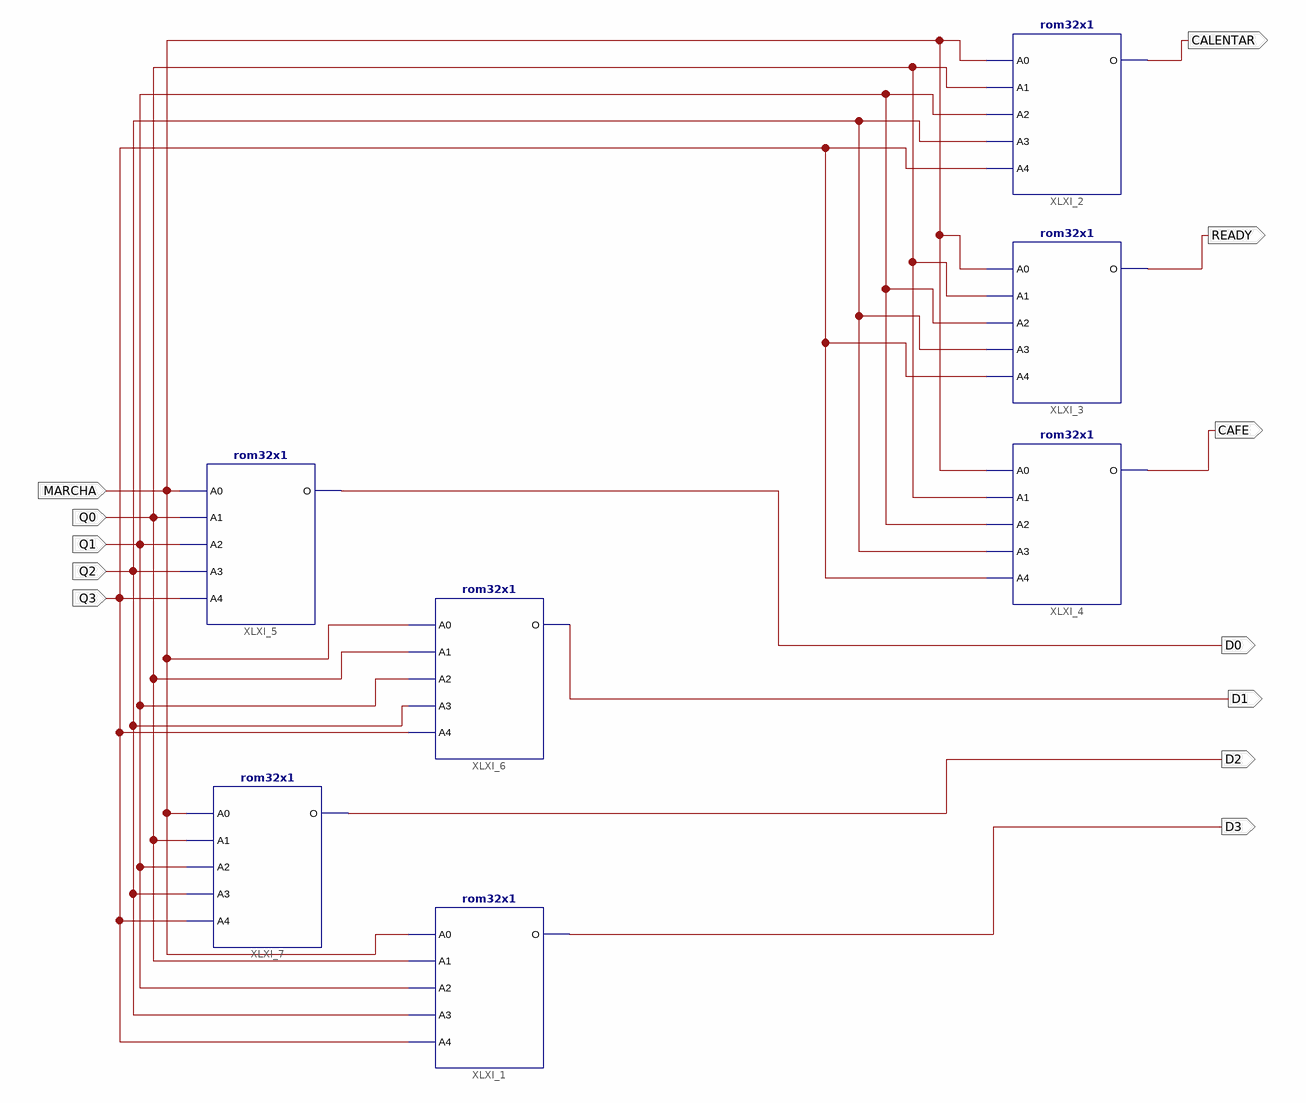
[diagram p0: schematic sheet 1]
// Xilinx ISE schematic Memoria.sch (spartan3) as structural Verilog: 7 symbols, 12 ports
module Memoria (
  input  MARCHA,
  input  Q0,
  input  Q1,
  input  Q2,
  input  Q3,
  output D0,
  output D1,
  output D2,
  output D3,
  output CALENTAR,
  output READY,
  output CAFE
);

  rom32x1 #(.INIT("00FFC000")) XLXI_1 (.A0(MARCHA), .A1(Q0), .A2(Q1), .A3(Q2), .A4(Q3), .O(D3));
  rom32x1 #(.INIT("000000FC")) XLXI_2 (.A0(MARCHA), .A1(Q0), .A2(Q1), .A3(Q2), .A4(Q3), .O(CALENTAR));
  rom32x1 #(.INIT("00000300")) XLXI_3 (.A0(MARCHA), .A1(Q0), .A2(Q1), .A3(Q2), .A4(Q3), .O(READY));
  rom32x1 #(.INIT("03FFFC00")) XLXI_4 (.A0(MARCHA), .A1(Q0), .A2(Q1), .A3(Q2), .A4(Q3), .O(CAFE));
  rom32x1 #(.INIT("00333233")) XLXI_5 (.A0(MARCHA), .A1(Q0), .A2(Q1), .A3(Q2), .A4(Q3), .O(D0));
  rom32x1 #(.INIT("003C3C3C")) XLXI_6 (.A0(MARCHA), .A1(Q0), .A2(Q1), .A3(Q2), .A4(Q3), .O(D1));
  rom32x1 #(.INIT("03C03FC0")) XLXI_7 (.A0(MARCHA), .A1(Q0), .A2(Q1), .A3(Q2), .A4(Q3), .O(D2));
endmodule
